# EAGLE design minimumduino-lenoardo (EAGLE 8.6.3)
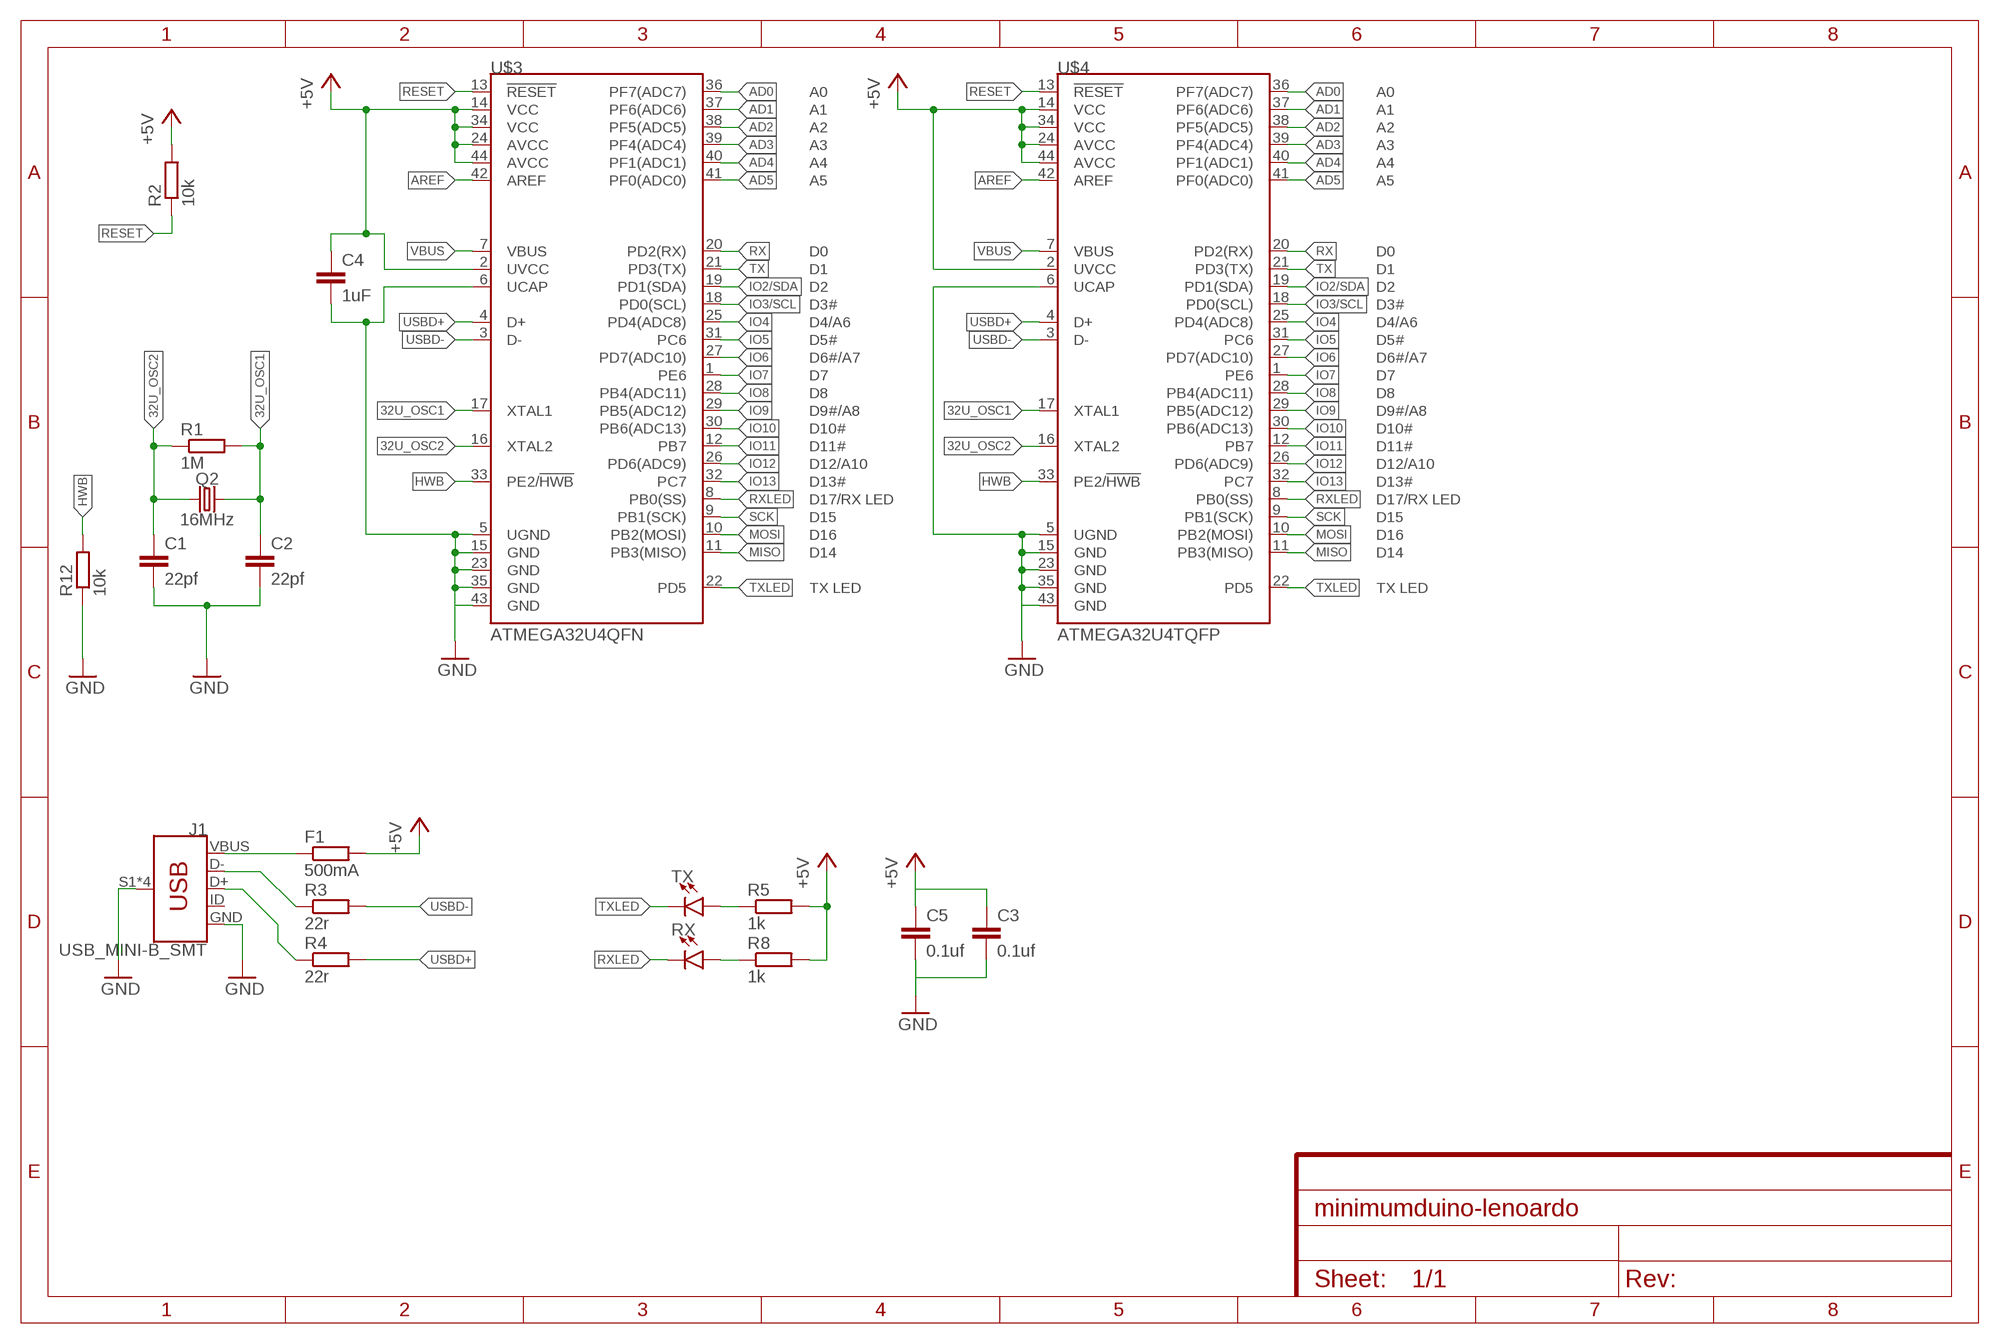
[diagram p0: schematic, sheet 1]

## Parts
C1  22pf  C-EUC0805  [C0805]
C2  22pf  C-EUC0805  [C0805]
C3  0.1uf  C-EUC0805  [C0805]
C4  1uF  C-EUC0805  [C0805]
C5  0.1uf  C-EUC0805  [C0805]
F1  500mA  R-EU_R1206  [R1206]
J1  USB_MINI-B_SMT  [USB-MINIB]
Q2  16MHz  CRYSTAL-16MHZSMD-5X3.2  [CRYSTAL-SMD-5X3.2-4PAD]
R1  1M  R-EU_R0805  [R0805]
R2  10k  R-EU_R0805  [R0805]
R3  22r  R-EU_R0805  [R0805]
R4  22r  R-EU_R0805  [R0805]
R5  1k  R-EU_R0805  [R0805]
R8  1k  R-EU_R0805  [R0805]
R12  10k  R-EU_R0805  [R0805]
RX  LED1206  [LED-1206]
TX  LED1206  [LED-1206]
U$3  ATMEGA32U4QFN  [SPARKFUN-DIGITALIC_QFN-44]
U$4  ATMEGA32U4TQFP  [SPARKFUN-DIGITALIC_TQFP44]

## Nets
32U_OSC1: C2.1 Q2.3 R1.2 U$3.17(XTAL1) U$4.17(XTAL1)
32U_OSC2: C1.1 Q2.1 R1.1 U$3.16(XTAL2) U$4.16(XTAL2)
+5V [power usb]: C3.1 C4.1 C5.1 F1.2 R2.2 R5.2 R8.2 U$3.2(UVCC) U$3.14(VCC) U$3.24(AVCC) U$3.34(VCC) U$3.44(AVCC) U$4.2(UVCC) U$4.14(VCC) U$4.24(AVCC) U$4.34(VCC) U$4.44(AVCC)
AD0: U$3.36(PF7(ADC7)) U$4.36(PF7(ADC7))
AD1: U$3.37(PF6(ADC6)) U$4.37(PF6(ADC6))
AD2: U$3.38(PF5(ADC5)) U$4.38(PF5(ADC5))
AD3: U$3.39(PF4(ADC4)) U$4.39(PF4(ADC4))
AD4: U$3.40(PF1(ADC1)) U$4.40(PF1(ADC1))
AD5: U$3.41(PF0(ADC0)) U$4.41(PF0(ADC0))
AREF: U$3.42(AREF) U$4.42(AREF)
GND [gnd]: C1.2 C2.2 C3.2 C4.2 C5.2 J1.GND J1.S1(SHIELD) J1.S2(SHIELD) J1.S3(SHIELD) J1.S4(SHIELD) R12.1 U$3.5(UGND) U$3.6(UCAP) U$3.15(GND) U$3.23(GND) U$3.35(GND) U$3.43(GND) U$4.5(UGND) U$4.6(UCAP) U$4.15(GND) U$4.23(GND) U$4.35(GND) U$4.43(GND)
HWB: R12.2 U$3.33(PE2/!HWB) U$4.33(PE2/!HWB)
IO2/SDA: U$3.19(PD1(SDA)) U$4.19(PD1(SDA))
IO3/SCL: U$3.18(PD0(SCL)) U$4.18(PD0(SCL))
IO4: U$3.25(PD4(ADC8)) U$4.25(PD4(ADC8))
IO5: U$3.31(PC6) U$4.31(PC6)
IO6: U$3.27(PD7(ADC10)) U$4.27(PD7(ADC10))
IO7: U$3.1(PE6) U$4.1(PE6)
IO8: U$3.28(PB4(ADC11)) U$4.28(PB4(ADC11))
IO9: U$3.29(PB5(ADC12)) U$4.29(PB5(ADC12))
IO10: U$3.30(PB6(ADC13)) U$4.30(PB6(ADC13))
IO11: U$3.12(PB7) U$4.12(PB7)
IO12: U$3.26(PD6(ADC9)) U$4.26(PD6(ADC9))
IO13: U$3.32(PC7) U$4.32(PC7)
MISO: U$3.11(PB3(MISO)) U$4.11(PB3(MISO))
MOSI: U$3.10(PB2(MOSI)) U$4.10(PB2(MOSI))
N$6: R8.1 RX.A
N$7: R5.1 TX.A
RESET: R2.1 U$3.13(!RESET) U$4.13(!RESET)
RX: U$3.20(PD2(RX)) U$4.20(PD2(RX))
RXLED: RX.C U$3.8(PB0(SS)) U$4.8(PB0(SS))
SCK: U$3.9(PB1(SCK)) U$4.9(PB1(SCK))
TX: U$3.21(PD3(TX)) U$4.21(PD3(TX))
TXLED: TX.C U$3.22(PD5) U$4.22(PD5)
USBD+: R4.2 U$3.4(D+) U$4.4(D+)
USBD-: R3.2 U$3.3(D-) U$4.3(D-)
USBR+: J1.D+ R4.1
USBR-: J1.D- R3.1
VBUS: U$3.7(VBUS) U$4.7(VBUS)
VBUS_UNFUSED: F1.1 J1.VBUS
Unconnected: J1.ID

## Library data of the parts
C1-C5 = rcl:C-EU: CAPACITOR, European symbol; SPICEPREFIX: C
F1 R1-R5 R8 R12 = rcl:R-EU_: RESISTOR, European symbol; SPICEPREFIX: R
J1 = SparkFun-Connectors:USB_MINI-B: USB type Mini-B Connector Breaks out 5th pin, and includes shield pins if needed. SparkFun Products: SparkFun FTDI Basic Breakout <https://www.sparkfun.com/products/9716> SparkFun XBee Explorer USB <https://www.sparkfun.com/products/11812> SparkFun Redboard <https://www.sparkfun.com/products/12757>; PROD_ID: CONN-08193; SF_ID: PRT-00587
Q2 = SparkFun-Clocks:CRYSTAL-16MHZ: 16MHz Crystal Digikey Example <http://www.digikey.com/product-search/en?keywords=535-9122-1-ND> Frequency: 16MHz Frequency Stability: ±50ppm Frequency Tolerance: ±20ppm Load Capacitance: 18pF SparkFun Products: Pro Micro -5V/16MHz <https://www.sparkfun.com/products/12640> SparkFun Serial Enabled LCD Kit <https://www.sparkfun.com/products/10097>; PROD_ID: XTAL-08218; SF_ID: COM-00094
RX TX = SparkFun-LED:LED: LED (Generic) Standard schematic elements and footprints for 5mm, 3mm, 1206, and 0603 sized LEDs. Generic LEDs with no color specified.
U$3 = SparkFun-Retired:ATMEGA32U4: Atmel 44-pin 8-bit Microcontroller with 32KBytes of ISP Flash and USB Controller ----- Please use the QFN-44-NOPAD_1:1 package for the footprint of all boards using a 32U4. Route traces directly away from the pads as much as possible.
U$4 = SparkFun-Retired:ATMEGA32U4: Atmel 44-pin 8-bit Microcontroller with 32KBytes of ISP Flash and USB Controller ----- Please use the QFN-44-NOPAD_1:1 package for the footprint of all boards using a 32U4. Route traces directly away from the pads as much as possible.; PROD_ID: IC-11161

## Net classes
2 gnd: width 0.305 mm, drill 0.406 mm, clearance 0.203 mm
3 power usb: width 0.508 mm, drill 0.406 mm, clearance 0.203 mm

## Board
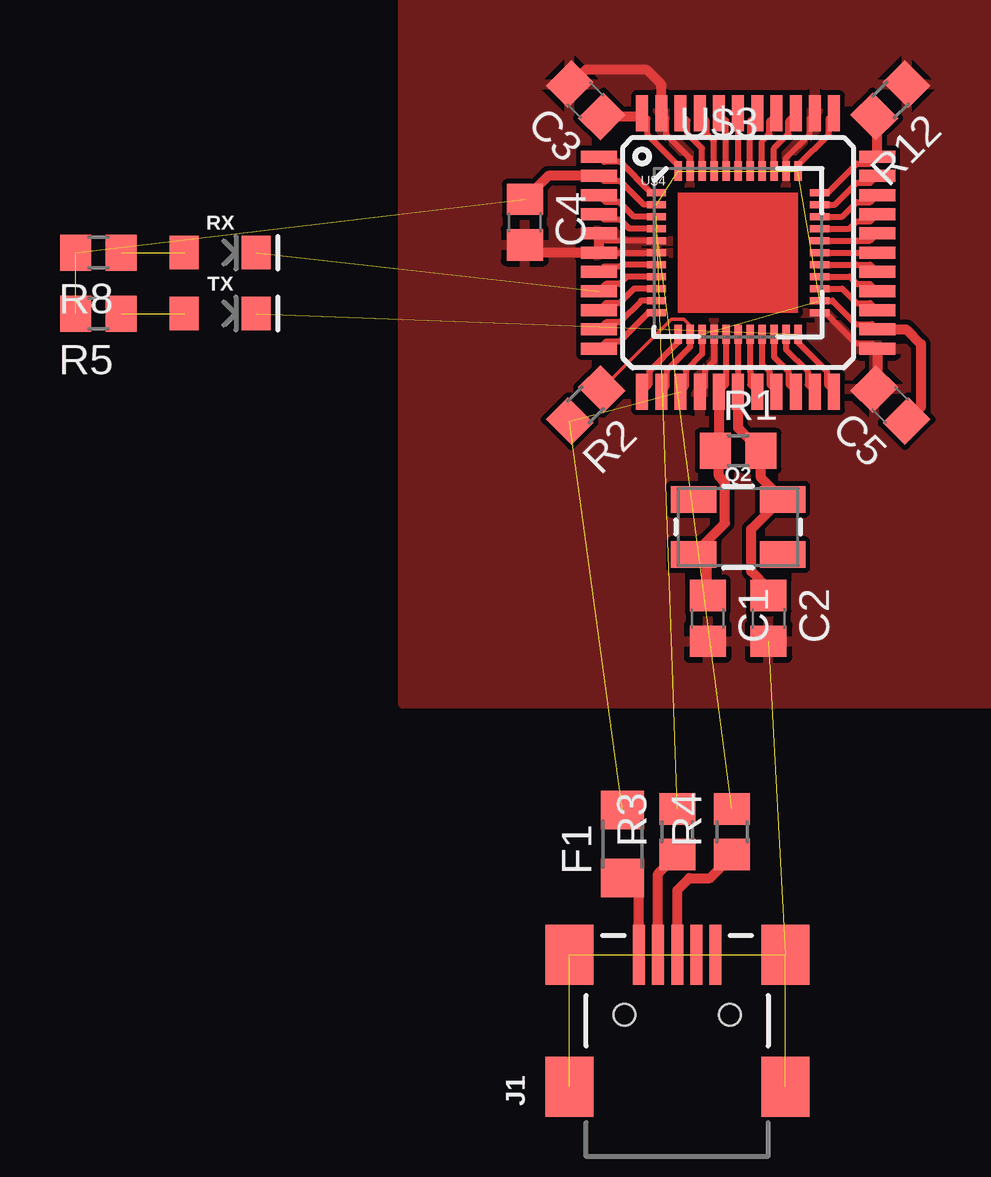
[diagram p1: board, top side]

No outline drawn. Coordinates in mm, seen from the top.
Copper layers (1*16): Top 0.035mm / dielectric 1.5mm / Bottom 0.035mm
Design rules "dirtypcbs": minimum track width 5mil, minimum drill 12mil, track to track 5mil, track to pad 5mil, pad to pad 5mil, via to via 5mil, smd to smd 0mil, copper to edge 10mil, drill to drill 10mil, minimum pad ring 10mil, minimum via ring 6mil, stop-mask expansion 2mil, vias tented up to drill 25mil, thermal gap 10mil

### Footprints (pad centres in the part's own frame; a part is rotated, then mirrored left to right if it is on the bottom)
C0805 = smd 1.3 x 1.5: 1 -0.95,0; 2 0.95,0
R1206 = smd 1.6 x 1.803: 1 -1.422,0; 2 1.422,0
USB-MINIB = smd 2.5 x 0.5: D+ 2.5,0; D- 2.5,0.8; GND 2.5,-1.6; ID 2.5,-0.8; VBUS 2.5,1.6 | smd 2.5 x 2: S1 -3,4.5; S2 2.5,4.5; S3 -3,-4.5; S4 2.5,-4.5 | hole 0.9: 0,2.2; 0,-2.2
CRYSTAL-SMD-5X3.2-4PAD = smd 1.9 x 1.1: 1 -1.85,-1.15; 2 1.85,-1.15; 3 1.85,1.15; 4 -1.85,1.15
R0805 = smd 1.3 x 1.5: 1 -0.95,0; 2 0.95,0
LED-1206 = smd 1.2 x 1.4: A -1.5,0; C 1.5,0
SPARKFUN-DIGITALIC_QFN-44 = smd 0.8 x 0.3: 1 -3.4,2.5; 2 -3.4,2; 3 -3.4,1.5; 4 -3.4,1; 5 -3.4,0.5; 6 -3.4,0; 7 -3.4,-0.5; 8 -3.4,-1; 9 -3.4,-1.5; 10 -3.4,-2; 11 -3.4,-2.5; 23 3.4,-2.5; 24 3.4,-2; 25 3.4,-1.5; 26 3.4,-1; 27 3.4,-0.5; 28 3.4,0; 29 3.4,0.5; 30 3.4,1; 31 3.4,1.5; 32 3.4,2; 33 3.4,2.5 | smd 0.3 x 0.8: 12 -2.5,-3.4; 13 -2,-3.4; 14 -1.5,-3.4; 15 -1,-3.4; 16 -0.5,-3.4; 17 0,-3.4; 18 0.5,-3.4; 19 1,-3.4; 20 1.5,-3.4; 21 2,-3.4; 22 2.5,-3.4; 34 2.5,3.4; 35 2,3.4; 36 1.5,3.4; 37 1,3.4; 38 0.5,3.4; 39 0,3.4; 40 -0.5,3.4; 41 -1,3.4; 42 -1.5,3.4; 43 -2,3.4; 44 -2.5,3.4
SPARKFUN-DIGITALIC_TQFP44 = smd 1.5 x 0.5: 1 -5.8,4; 2 -5.8,3.2; 3 -5.8,2.4; 4 -5.8,1.6; 5 -5.8,0.8; 6 -5.8,0; 7 -5.8,-0.8; 8 -5.8,-1.6; 9 -5.8,-2.4; 10 -5.8,-3.2; 11 -5.8,-4; 23 5.8,-4; 24 5.8,-3.2; 25 5.8,-2.4; 26 5.8,-1.6; 27 5.8,-0.8; 28 5.8,0; 29 5.8,0.8; 30 5.8,1.6; 31 5.8,2.4; 32 5.8,3.2; 33 5.8,4 | smd 0.5 x 1.5: 12 -4,-5.8; 13 -3.2,-5.8; 14 -2.4,-5.8; 15 -1.6,-5.8; 16 -0.8,-5.8; 17 0,-5.8; 18 0.8,-5.8; 19 1.6,-5.8; 20 2.4,-5.8; 21 3.2,-5.8; 22 4,-5.8; 34 4,5.8; 35 3.2,5.8; 36 2.4,5.8; 37 1.6,5.8; 38 0.8,5.8; 39 0,5.8; 40 -0.8,5.8; 41 -1.6,5.8; 42 -2.4,5.8; 43 -3.2,5.8; 44 -4,5.8

### Placement (x,y rotation side)
C1  57.15,33.02 270 top
C2  59.69,33.02 270 top
C3  52.07,54.61 135 top
C4  49.53,49.53 270 top
C5  64.77,41.91 135 top
F1  53.59,23.62 90 top
J1  55.88,16.51 90 top
Q2  58.42,36.83 0 top
R1  58.42,40.01 0 top
R2  52.07,41.91 225 top
R3  55.88,24.13 90 top
R4  58.17,24.13 90 top
R5  31.75,45.72 180 top
R8  31.75,48.26 180 top
R12  64.77,54.61 225 top
RX  36.83,48.26 0 top
TX  36.83,45.72 0 top
U$3  58.42,48.26 0 top
U$4  58.42,48.26 0 top

### Tracks (layer width: path | path; a pad name or v marks a point on that pad's centre or on a via)
32U_OSC1
  Top 0.254: U$3.17 U$4.17
  Top 0.406: U$4.17 58.42,40.96 58.48,40.9 R1.2 59.37,38.88 60.24,38.01 | Q2.3 60.24,38.01 | C2.1 59.69,34.26 58.96,34.98 58.96,36.74 60.24,38.01
32U_OSC2
  Top 0.254: U$3.16 57.92,43.32 57.92,43.31 57.92,42.76 U$4.16
  Top 0.406: U$4.16 57.62,40.16 | 57.62,40.16 R1.1 | 57.62,40.16 57.62,38.93 57.88,38.68 57.88,36.99 57.12,36.23 | Q2.1 57.12,36.23 | C1.1 57.12,34 57.12,36.23
+5V  (8 unrouted)
  Top 0.254: U$4.24 64,45.28 63.33,45.28 62.35,46.26 U$3.24 | U$4.34 62.2,53.84 62.2,53.17 60.92,51.89 U$3.34 | U$4.44 54.64,53.84 54.64,53.17 55.92,51.89 U$3.44 | U$4.2 52.84,51.24 53.51,51.24 54.49,50.26 U$3.2 | U$4.14 56.24,42.68 56.24,43.35 56.92,44.03 U$3.14
  Top 0.406: U$4.2 50.51,51.46 C4.1 | C3.1 54.3,53.94 U$4.44 | U$4.24 65.43,45.06 66.04,44.45 66.04,41.84 C5.1
AD0
  Top 0.254: U$4.36 60.52,53.76 60.52,53.2 59.92,52.6 U$3.36
AD1
  Top 0.254: U$4.37 59.72,53.76 59.72,53.2 59.42,52.9 U$3.37
AD2
  Top 0.254: U$3.38 58.92,53.2 58.92,53.76 U$4.38
AD3
  Top 0.254: U$4.39 U$3.39
AD4
  Top 0.254: U$3.40 57.92,53.2 57.92,53.76 U$4.40
AD5
  Top 0.254: U$4.41 57.12,53.76 57.12,53.2 57.42,52.9 U$3.41
AREF
  Top 0.254: U$4.42 56.32,53.76 56.32,53.2 56.92,52.6 U$3.42
GND  (5 unrouted)
  Top 0.254: U$4.6 U$3.6 | U$4.23 64,44.48 63.33,44.48 62.05,45.76 U$3.23 | U$4.35 61.4,53.84 61.4,53.17 60.42,52.19 U$3.35 | U$4.43 55.44,53.84 55.44,53.17 56.42,52.19 U$3.43 | U$3.5 52.92,48.76 U$4.5 | U$4.15 57.04,42.68 57.04,43.35 57.42,43.73 U$3.15
  Top 0.406: C4.2 49.85,48.26 U$4.6 U$4.5 | U$4.23 64.22,42.7 C5.2 | C3.2 51.47,55.28 52.07,55.88 54.61,55.88 55.22,55.27 U$4.43
  pour Top: 44.45,60.45 72.9,60.45 72.9,29.46 44.45,29.46
HWB
  Top 0.254: U$4.33 63.92,51.96 63.37,51.96 62.16,50.76 U$3.33
  Top 0.406: U$4.33 64.22,53.82 R12.2
IO2/SDA
  Top 0.254: U$4.19 59.72,42.76 59.72,43.31 59.42,43.62 U$3.19
IO3/SCL
  Top 0.254: U$3.18 58.92,43.32 58.92,43.31 58.92,42.76 U$4.18
IO4
  Top 0.254: U$4.25 63.92,46.16 63.37,46.16 62.76,46.76 U$3.25
IO5
  Top 0.254: U$4.31 63.92,50.36 63.37,50.36 62.76,49.76 U$3.31
IO6
  Top 0.254: U$3.27 63.36,47.76 63.37,47.76 63.92,47.76 U$4.27
IO7
  Top 0.254: U$4.1 52.84,52.04 53.51,52.04 54.79,50.76 U$3.1
IO8
  Top 0.254: U$3.28 U$4.28
IO9
  Top 0.254: U$3.29 63.36,48.76 63.37,48.76 63.92,48.76 U$4.29
IO10
  Top 0.254: U$4.30 63.92,49.56 63.37,49.56 63.06,49.26 U$3.30
IO11
  Top 0.254: U$4.12 54.72,42.76 54.72,43.31 55.92,44.52 U$3.12
IO12
  Top 0.254: U$4.26 63.92,46.96 63.37,46.96 63.06,47.26 U$3.26
IO13
  Top 0.254: U$4.32 63.92,51.16 63.37,51.16 62.46,50.26 U$3.32
MISO
  Top 0.254: U$4.11 52.92,44.56 53.48,44.56 54.68,45.76 U$3.11
MOSI
  Top 0.254: U$4.10 52.92,45.36 53.48,45.36 54.38,46.26 U$3.10
N$6  (1 unrouted)
N$7  (1 unrouted)
RESET
  Top 0.152: R2.1 55.65,45.49 56.16,45.49 56.42,45.23 U$3.13
  Top 0.254: U$4.13 55.44,42.68 55.44,43.35 56.42,44.33 U$3.13
RX
  Top 0.254: U$4.20 60.52,42.76 60.52,43.31 59.92,43.92 U$3.20
RXLED  (1 unrouted)
  Top 0.254: U$4.8 52.92,46.96 53.48,46.96 53.78,47.26 U$3.8
SCK
  Top 0.254: U$4.9 52.92,46.16 53.48,46.16 54.08,46.76 U$3.9
TX
  Top 0.254: U$4.21 61.32,42.76 61.32,43.31 60.42,44.22 U$3.21
TXLED  (1 unrouted)
  Top 0.254: U$4.22 62.12,42.76 62.12,43.31 60.92,44.52 U$3.22
USBD+  (1 unrouted)
  Top 0.254: U$4.4 52.84,49.64 53.51,49.64 53.89,49.26 U$3.4
USBD-  (1 unrouted)
  Top 0.254: U$4.3 52.92,50.36 53.48,50.36 54.08,49.76 U$3.3
USBR+
  Top 0.406: J1.D+ 55.88,21.69 56.39,22.2 57.25,22.2 58.17,23.11 R4.1
USBR-
  Top 0.406: J1.D- 55.08,22.38 R3.1
VBUS
  Top 0.254: U$3.7 53.59,47.76 53.51,47.68 52.84,47.68 U$4.7
VBUS_UNFUSED
  Top 0.406: J1.VBUS 54.28,21.51 F1.1